# EAGLE design SPEKTRUM_Current_Usage_Sense REV_B (EAGLE 7.1.0)
Spektrum Telemetry Sensor Rev B
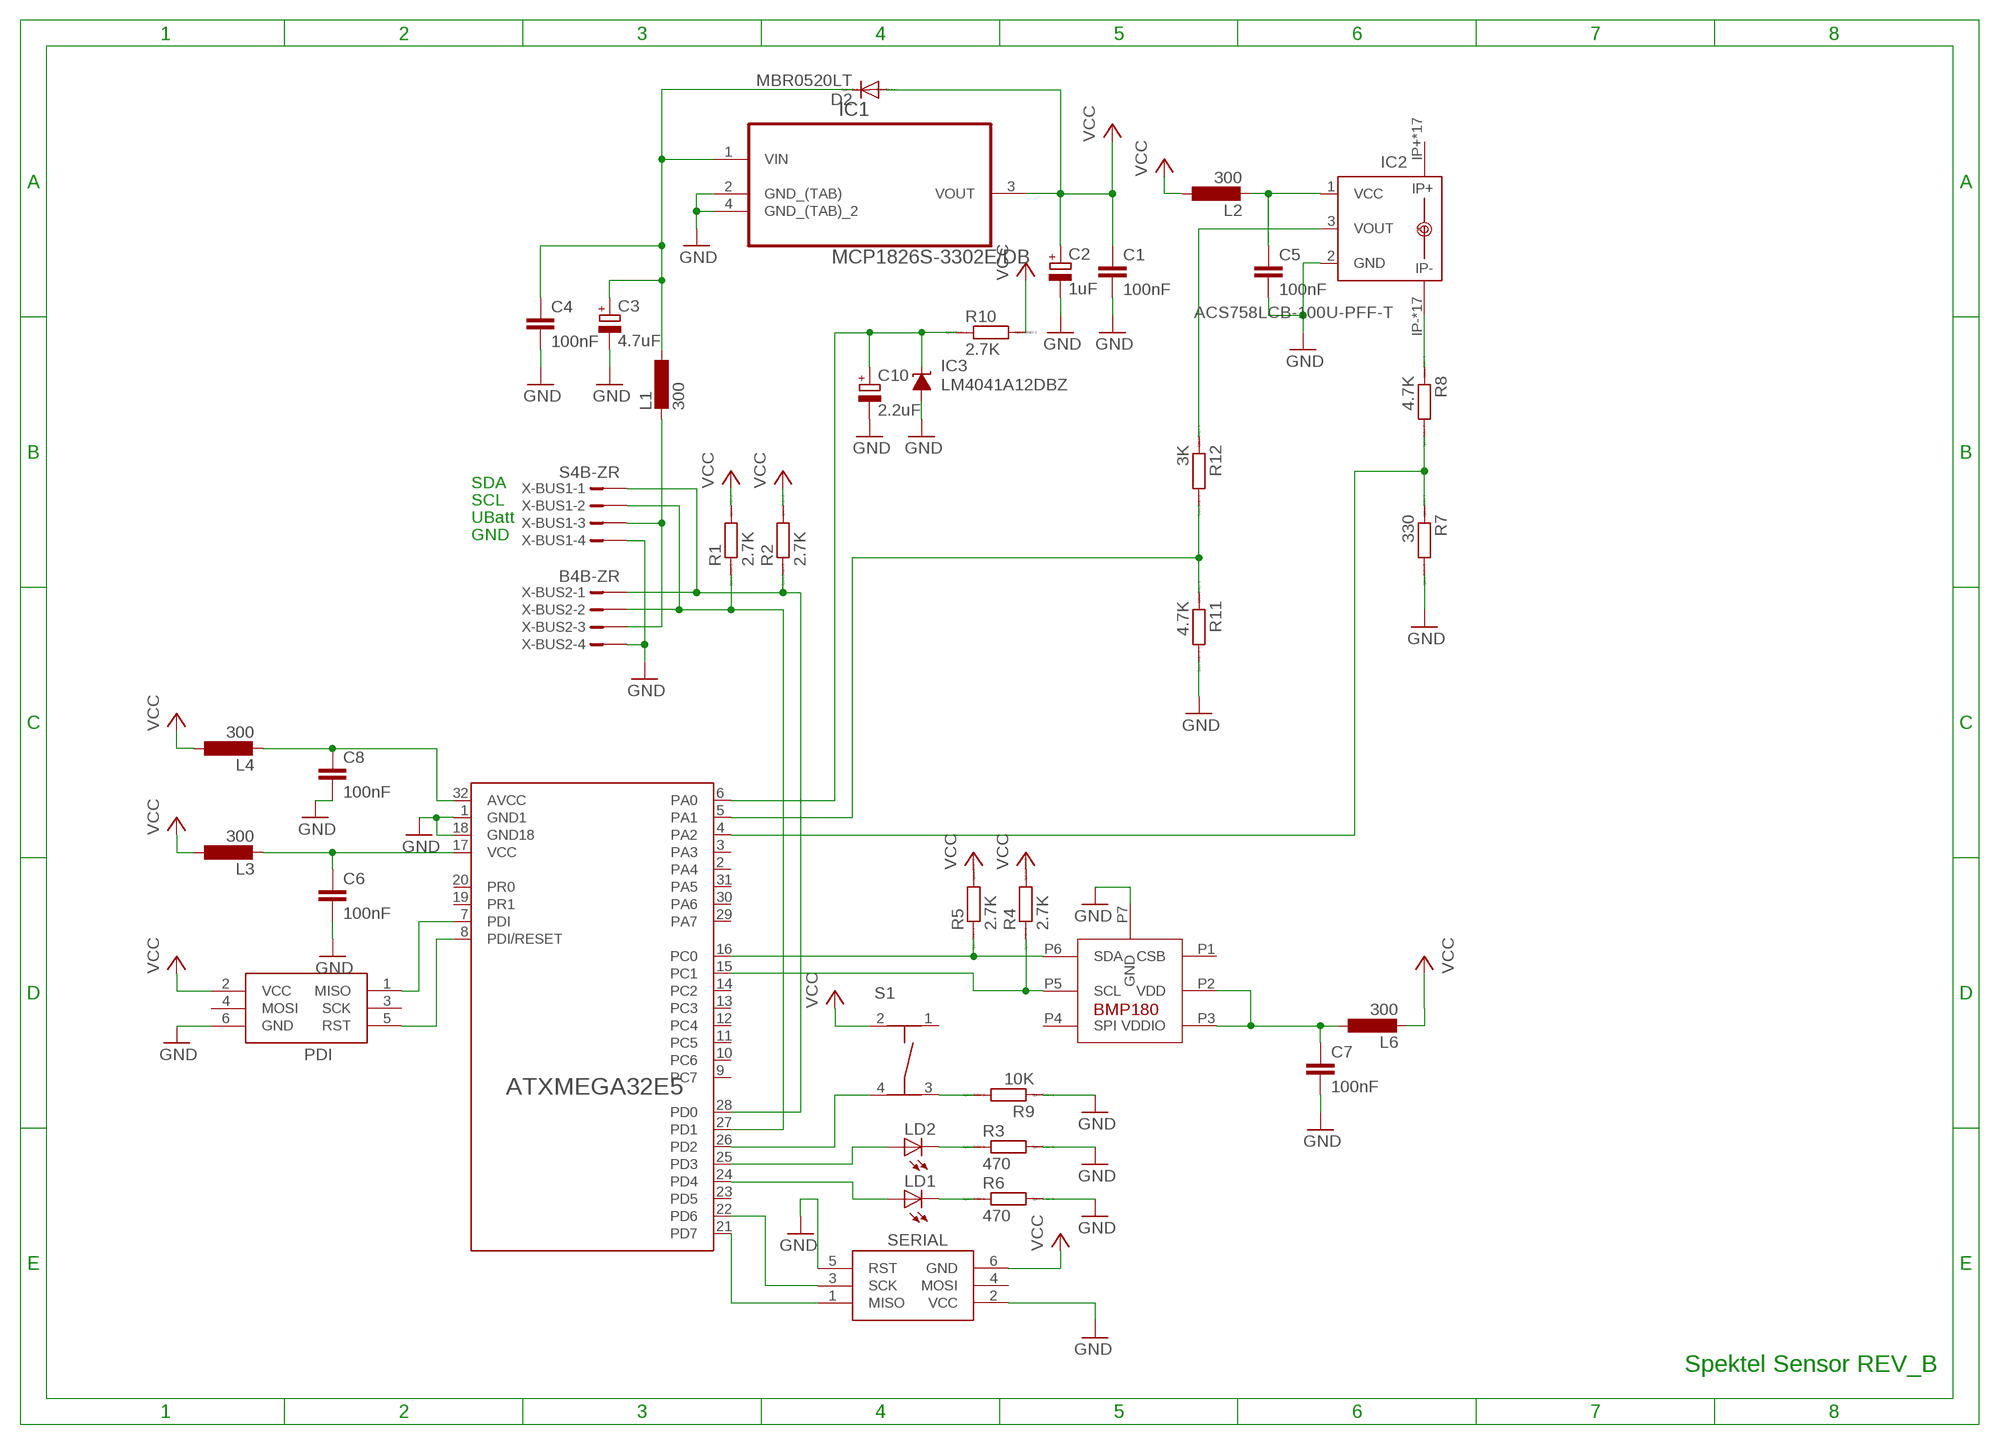
[diagram p0: schematic, sheet 1]

## Parts
ATXMEGA32E5  ATXMEGA32E5/16E5/8E5ATXMEGA32E5-AU  [TQFP32-08]
BMP180  BMP180  [BMP180_LGA7]
C1  100nF  C-EUC0603  [C0603]
C2  1uF  CPOL-EUA/3216-18W  [A/3216-18W]
C3  4.7uF  CPOL-EUA/3216-18W  [A/3216-18W]
C4  100nF  C-EUC0603  [C0603]
C5  100nF  C-EUC0603  [C0603]
C6  100nF  C-EUC0603  [C0603]
C7  100nF  C-EUC0603  [C0603]
C8  100nF  C-EUC0603  [C0603]
C10  2.2uF  CPOL-EUA/3216-18W  [A/3216-18W]
D2  MBR0520LT  [SOD123]
IC1  MCP1826S-3302E/DB  [SOT230P700X180-4N]
IC2  ACS758LCB-100U-PFF-T  ACS758LCB-100B-PFF-T  [CB-PFF]
IC3  LM4041A12DBZ  [DBZ_R-PDSO-G3]
L1  300  L-EU  [L0603]
L2  300  L-EU  [L0603]
L3  300  L-EU  [L0603]
L4  300  L-EU  [L0603]
L6  300  L-EU  [L0603]
LD1  LEDCHIPLED_0603  [CHIPLED_0603]
LD2  LEDCHIPLED_0603  [CHIPLED_0603]
PDI  AVRISP-6  [AVRISP]
R1  2.7K  R-EU_R0603  [R0603]
R2  2.7K  R-EU_R0603  [R0603]
R3  470  R-EU_R0603  [R0603]
R4  2.7K  R-EU_R0603  [R0603]
R5  2.7K  R-EU_R0603  [R0603]
R6  470  R-EU_R0603  [R0603]
R7  330  R-EU_R0603  [R0603]
R8  4.7K  R-EU_R0603  [R0603]
R9  10K  R-EU_R0603  [R0603]
R10  2.7K  R-EU_R0603  [R0603]
R11  4.7K  R-EU_R0603  [R0603]
R12  3K  R-EU_R0603  [R0603]
S1  TASTER-9314_SMD  [TASTER-9314_SMD]
SERIAL  AVRISP-6  [AVRISP]
X-BUS1  S4B-ZR  [S4B-ZR]
X-BUS2  B4B-ZR  [B4B-ZR]

## Nets
ADC_CURRENT: ATXMEGA32E5.5(PA1) R11.1 R12.2
ADC_VOLTAGE: ATXMEGA32E5.4(PA2) R7.1 R8.2
AREF: ATXMEGA32E5.6(PA0) C10.+ IC3.1(C) R10.1
AVCCMC: ATXMEGA32E5.32(AVCC) C8.1 L4.2
D_BUTTON: ATXMEGA32E5.26(PD2) S1.4
GND: ATXMEGA32E5.1(GND1) ATXMEGA32E5.18(GND18) BMP180.P7(GND) C1.2 C2.- C3.- C4.2 C5.2 C6.2 C7.2 C8.2 C10.- IC1.2(GND_(TAB)) IC1.4(GND_(TAB)_2) IC2.2(GND) IC3.2(A) PDI.6(GND) R3.2 R6.2 R7.2 R9.1 R11.2 SERIAL.2(VCC) SERIAL.5(RST) X-BUS1.4 X-BUS2.4
LED1: ATXMEGA32E5.24(PD4) LD1.A
LED2: ATXMEGA32E5.25(PD3) LD2.A
N$2: L1.2 X-BUS1.3 X-BUS2.3
N$3: LD2.C R3.1
N$4: C5.1 IC2.1(VCC) L2.2
N$6: LD1.C R6.1
N$7: BMP180.P2(VDD) BMP180.P3(VDDIO) C7.1 L6.1
N$8: R9.2 S1.3
N$10: IC2.3(VOUT) R12.1
N$12: ATXMEGA32E5.7(PDI) PDI.1(MISO)
N$13: ATXMEGA32E5.8(PDI/RESET) PDI.5(RST)
RXD0: ATXMEGA32E5.22(PD6) SERIAL.3(SCK)
SENS_CUR_-: IC2.IP- IC2.IP-@2(IP-) IC2.IP-@3(IP-) IC2.IP-@4(IP-) IC2.IP-@5(IP-) IC2.IP-@6(IP-) IC2.IP-@7(IP-) IC2.IP-@8(IP-) IC2.IP-@9(IP-) IC2.IP-@10(IP-) IC2.IP-@11(IP-) IC2.IP-@12(IP-) IC2.IP-@13(IP-) IC2.IP-@14(IP-) IC2.IP-@15(IP-) IC2.IP-@16(IP-) IC2.IP-@17(IP-) R8.1
TWIM_SCL: ATXMEGA32E5.15(PC1) BMP180.P5(SCL) R4.1
TWIM_SDA: ATXMEGA32E5.16(PC0) BMP180.P6(SDA) R5.1
TWIS_SCL: ATXMEGA32E5.27(PD1) R1.1 X-BUS1.2 X-BUS2.2
TWIS_SDA: ATXMEGA32E5.28(PD0) R2.1 X-BUS1.1 X-BUS2.1
TXD0: ATXMEGA32E5.21(PD7) SERIAL.1(MISO)
UBATT: C3.+ C4.1 D2.C IC1.1(VIN) L1.1
VCC: C1.1 C2.+ D2.A IC1.3(VOUT) L2.1 L3.1 L4.1 L6.2 PDI.2(VCC) R1.2 R2.2 R4.2 R5.2 R10.2 S1.2 SERIAL.6(GND)
VCCMC: ATXMEGA32E5.17(VCC) C6.1 L3.2
Unconnected: ATXMEGA32E5.2(PA4) ATXMEGA32E5.3(PA3) ATXMEGA32E5.9(PC7) ATXMEGA32E5.10(PC6) ATXMEGA32E5.11(PC5) ATXMEGA32E5.12(PC4) ATXMEGA32E5.13(PC3) ATXMEGA32E5.14(PC2) ATXMEGA32E5.19(PR1) ATXMEGA32E5.20(PR0) ATXMEGA32E5.23(PD5) ATXMEGA32E5.29(PA7) ATXMEGA32E5.30(PA6) ATXMEGA32E5.31(PA5) BMP180.P1(CSB) BMP180.P4(SPI) IC2.IP+ IC2.IP+@2(IP+) IC2.IP+@3(IP+) IC2.IP+@4(IP+) IC2.IP+@5(IP+) IC2.IP+@6(IP+) IC2.IP+@7(IP+) IC2.IP+@8(IP+) IC2.IP+@9(IP+) IC2.IP+@10(IP+) IC2.IP+@11(IP+) IC2.IP+@12(IP+) IC2.IP+@13(IP+) IC2.IP+@14(IP+) IC2.IP+@15(IP+) IC2.IP+@16(IP+) IC2.IP+@17(IP+) PDI.3(SCK) PDI.4(MOSI) S1.1 SERIAL.4(MOSI)

## Notes on the sheet
- SDA
- SCL
- UBatt
- GND
- Spektel Sensor REV_B

## Library data of the parts
ATXMEGA32E5 = atmega-atxmega:ATXMEGA32E5/16E5/8E5: 8/16-bit Atmel AVR XMEGA Microcontrollers
BMP180 = bosch_sensors:BMP180: BMP 180 Digital Pressure Sensor with I2C Interface
C1 C4-C8 = rcl:C-EU: CAPACITOR, European symbol
C2 C3 C10 = rcl:CPOL-EU: POLARIZED CAPACITOR, European symbol
D2 = diode:MBR0520LT: SCHOTTKY BARRIER RECTIFIER Source: http://onsemi.com .. MBR0520LT1-D.pdf
IC1 = microchip_ldo:MCP1826S-3302E/DB: IC, LDO, 3.3V, 1A; MPN: MCP1826S-3302E/DB; OC_FARNELL: 1578424; OC_NEWARK: 27M0037; PACKAGE: SOT-223-3; SUPPLIER: Microchip
IC2 = allegro:ACS758*: Thermally Enhanced, Fully Integrated, Hall Effect-Based Linear Current Sensor with 100 micro Ohm Current Conductor display layer 49 Reference in BRD and place VIAs on circles Source: http://www.allegromicro.com/en/Products/Part_Numbers/0758/0758.pdf; MPN: ACS758LCB-100U-PFF-T; OC_FARNELL: 1718998; OC_NEWARK: 04R7132
IC3 = texas:LM4041: PRECISION MICROPOWER SHUNT VOLTAGE REFERENCE Source: http://focus.ti.com/lit/ds/slcs146e/slcs146e.pdf; MPN: LM4041A12IDBZR; OC_FARNELL: 1407949; OC_NEWARK: 58K5875
L1-L4 L6 = rcl:L-EU: INDUCTOR, European symbol
LD1 LD2 = adafruit:LED: LED OSRAM: - CHIPLED LG R971, LG N971, LY N971, LG Q971, LY Q971, LO R971, LY R971 LH N974, LH R974 LS Q976, LO Q976, LY Q976 LO Q996 - Hyper CHIPLED LW Q18S LB Q993, LB Q99A, LB R99A - SideLED LS A670, LO A670, LY A670, LG A670, LP A670 LB A673, LV A673, LT A673, LW A673 LH A674 LY A675 LS A676, LA A676, LO A676, LY A676, LW A676 LS A679, LY A679, LG A679 - Hyper Micro SIDELED® LS Y876, LA Y876, LO Y876, LY Y876 LT Y87S - SmartLED LW L88C, LW L88S LB L89C, LB L89S, LG L890 LS L89K, LO L89K, LY L89K LS L896, LA L896, LO L896, LY L896 - TOPLED LS T670, LO T670, LY T670, LG T670, LP T670 LSG T670, LSP T670, LSY T670, LOP T670, LYG T670 LG T671, LOG T671, LSG T671 LB T673, LV T673, LT T673, LW T673 LH T674 LS T676, LA T676, LO T676, LY T676, LB T676, LH T676, LSB T676, LW T676 LB T67C, LV T67C, LT T67C, LS T67K, LO T67K, LY T67K, LW E67C LS E67B, LA E67B, LO E67B, LY E67B, LB E67C, LV E67C, LT E67C LW T67C LS T679, LY T679, LG T679 LS T770, LO T770, LY T770, LG T770, LP T770 LB T773, LV T773, LT T773, LW T773 LH T774 LS E675, LA E675, LY E675, LS T675 LS T776, LA T776, LO T776, LY T776, LB T776 LHGB T686 LT T68C, LB T68C - Hyper Mini TOPLED® LB M676 - Mini TOPLED Santana® LG M470 LS M47K, LO M47K, LY M47K Source: http://www.osram.convergy.de/
PDI SERIAL = adafruit:AVRISP: AVR ISP HEADER Standard 6 pin header for AVR programming
R1-R12 = resistor:R-EU_: RESISTOR, European symbol; SPICEPREFIX: R
S1 = Ergaenzung:TASTER-9314_SMD
X-BUS1 = con-jst:?4B-ZR: ZH CONNECTOR 1.5 mm, 4 pin 1 row Source: http://www.jst.com .. eZH.pdf; MF: FARNELL; MPN: S4B-ZR(LF)(SN); OC_FARNELL: 9491830; OC_NEWARK: 38K8076
X-BUS2 = con-jst:?4B-ZR: ZH CONNECTOR 1.5 mm, 4 pin 1 row Source: http://www.jst.com .. eZH.pdf; MF: FARNELL; MPN: B4B-ZR(LF)(SN); OC_FARNELL: 1830916; OC_NEWARK: 37K9960

## Board
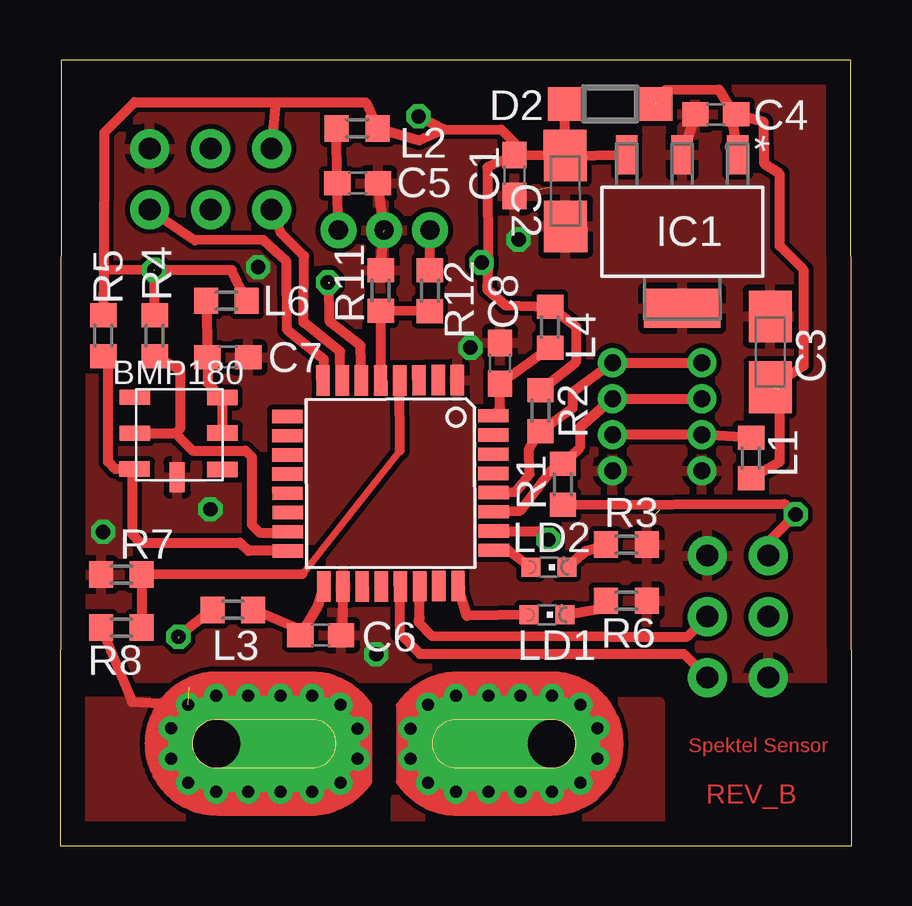
[diagram p1: board, top side]
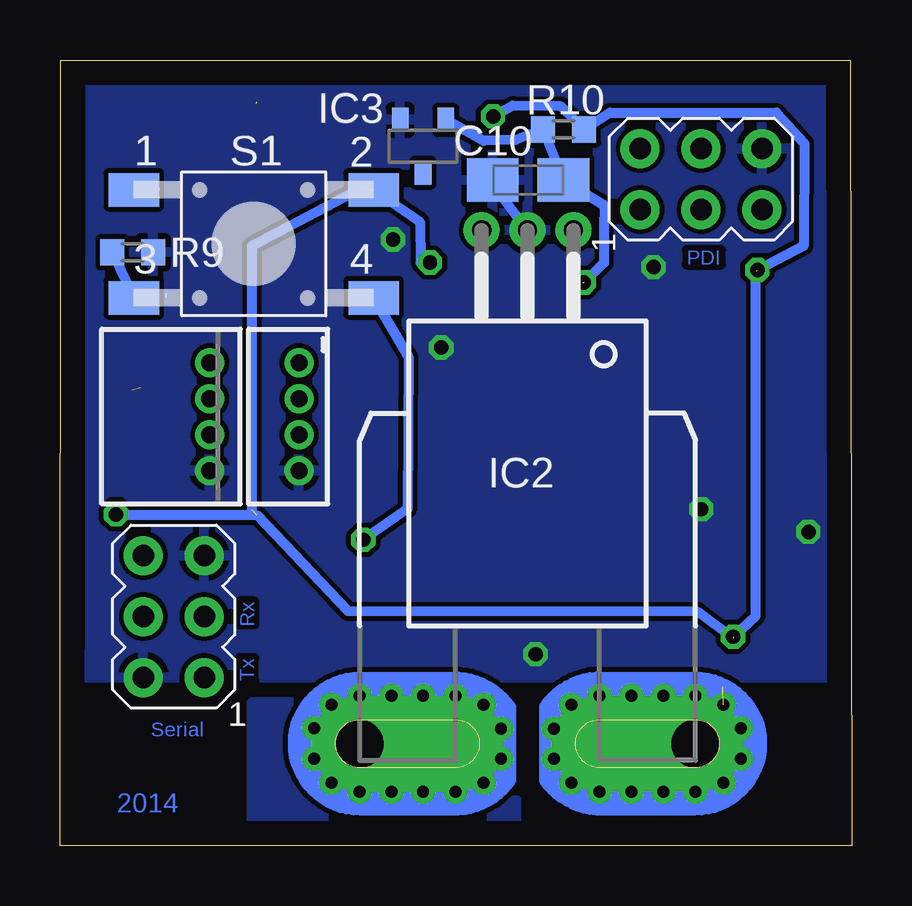
[diagram p2: board, bottom side, seen from below]

Size 33.01 x 32.74 mm. Coordinates in mm from the lower left corner, seen from the top.
Outline: 0,0 33.01,0 32.98,32.74 0.06,32.74 0,0
Copper layers (1*16): Top 0.035mm / dielectric 1.5mm / Bottom 0.035mm
Design rules "default *": minimum track width 10mil, minimum drill 17mil, track to track 8mil, track to pad 8mil, pad to pad 8mil, via to via 8mil, smd to smd 8mil, copper to edge 40mil, drill to drill 8mil, minimum pad ring 10mil, minimum via ring 8mil, stop-mask expansion 4mil, vias tented up to drill 0mil, thermal gap 10mil

### Footprints (pad centres in the part's own frame; a part is rotated, then mirrored left to right if it is on the bottom)
TQFP32-08 = smd 1.27 x 0.559: 1 -4.293,2.8; 2 -4.293,2; 3 -4.293,1.2; 4 -4.293,0.4; 5 -4.293,-0.4; 6 -4.293,-1.2; 7 -4.293,-2; 8 -4.293,-2.8; 17 4.293,-2.8; 18 4.293,-2; 19 4.293,-1.2; 20 4.293,-0.4; 21 4.293,0.4; 22 4.293,1.2; 23 4.293,2; 24 4.293,2.8 | smd 0.559 x 1.27: 9 -2.8,-4.293; 10 -2,-4.293; 11 -1.2,-4.293; 12 -0.4,-4.293; 13 0.4,-4.293; 14 1.2,-4.293; 15 2,-4.293; 16 2.8,-4.293; 25 2.8,4.293; 26 2,4.293; 27 1.2,4.293; 28 0.4,4.293; 29 -0.4,4.293; 30 -1.2,4.293; 31 -2,4.293; 32 -2.8,4.293
BMP180_LGA7 = smd 0.635 x 1.27: P1 1.455,1.685; P2 -0.065,1.695; P3 -1.545,1.685; P4 -1.555,-1.955; P5 -0.055,-1.955; P6 1.435,-1.975 | smd 1.27 x 0.635: P7 1.775,-0.195
C0603 = smd 1.1 x 1: 1 -0.85,0; 2 0.85,0
A/3216-18W = smd 2.15 x 1.8: + 1.475,0; - -1.475,0
SOD123 = smd 1.4 x 1.4: A 1.9,0; C -1.9,0
SOT230P700X180-4N = smd 1.626 x 0.889: 1 -3.2,2.311; 2 -3.2,0; 3 -3.2,-2.311 | smd 1.626 x 3.175: 4 3.2,0
CB-PFF = drill 0.8 pad 1.5: 1 -1.91,-21.4; 2 0,-21.4; 3 1.91,-21.4 | drill 2 pad 4 offset: IP+ 7,0; IP- -7,0 | drill 0.5 pad 0.9: IP+@2 8.89,0.635; IP+@3 8.89,-0.635; IP+@4 8.175,-1.625; IP+@5 7,-2; IP+@6 5.675,-2; IP+@7 4.35,-2; IP+@8 3,-2; IP+@9 1.825,-1.625; IP+@10 1.1,-0.625; IP+@11 1.1,0.625; IP+@12 1.825,1.625; IP+@13 3,2; IP+@14 4.35,2; IP+@15 5.675,2; IP+@16 7,2; IP+@17 8.175,1.625; IP-@2 -8.89,0.635; IP-@3 -8.89,-0.635; IP-@4 -8.175,-1.625; IP-@5 -7,-2; IP-@6 -5.675,-2; IP-@7 -4.325,-2; IP-@8 -3,-2; IP-@9 -1.825,-1.625; IP-@10 -1.1,-0.625; IP-@11 -1.1,0.625; IP-@12 -1.825,1.625; IP-@13 -3,2; IP-@14 -4.325,2; IP-@15 -5.675,2; IP-@16 -7,2; IP-@17 -8.175,1.625
DBZ_R-PDSO-G3 = smd 0.7 x 1: 1 -0.95,-1.1; 2 0.95,-1.1; 3 0,1.1
L0603 = smd 1 x 1.1: 1 -0.85,0; 2 0.85,0
CHIPLED_0603 = smd 0.8 x 0.8: A 0,-0.75; C 0,0.75
AVRISP = drill 0.9 pad 1.626: 1 -1.27,2.54; 2 1.27,2.54; 3 -1.27,0; 4 1.27,0; 5 -1.27,-2.54; 6 1.27,-2.54
R0603 = smd 1 x 1.1: 1 -0.85,0; 2 0.85,0
TASTER-9314_SMD = smd 2.1 x 1.4: 1 -5,2.25; 2 5,2.25; 3 -5,-2.25; 4 5,-2.25
S4B-ZR = drill 0.7 pad 1.1: 1 -2.25,0; 2 -0.75,0; 3 0.75,0; 4 2.25,0
B4B-ZR = drill 0.7 pad 1.1: 1 -2.25,0; 2 -0.75,0; 3 0.75,0; 4 2.25,0

### Placement (x,y rotation side)
ATXMEGA32E5  13.78,15.1 270.2 top
BMP180  5.08,17.13 270 top
C1  18.94,27.93 270 top
C2  21.07,27.28 90.3 top
C3  29.61,20.58 270 top
C4  27.34,30.47 180 top
C5  12.41,27.6 0 top
C6  10.87,8.78 0 top
C7  7,20.35 0 top
C8  18.35,20.1 90 top
C10  13.49,27.74 0 bottom
D2  22.94,30.91 180 top
IC1  25.94,25.59 270 top
IC2  13.52,4.25 180 bottom
IC3  17.87,29.15 180 bottom
L1  28.81,16.16 90 top
L2  12.39,29.89 180 top
L3  7.21,9.83 0 top
L4  20.43,21.61 270 top
L6  6.94,22.71 0 top
LD1  20.3,9.62 270 top
LD2  20.38,11.61 270 top
PDI  6.28,27.78 90 bottom
R1  20.97,15.06 270 top
R2  20.03,18.13 90 top
R3  23.61,12.55 0 top
R4  3.95,21.25 90 top
R5  1.81,21.25 90 top
R6  23.61,10.21 0 top
R7  2.56,11.3 180 top
R8  2.56,9.09 0 top
R9  29.97,24.73 180 bottom
R10  12.01,29.85 0 bottom
R11  13.37,23.14 90 top
R12  15.42,23.13 270 top
S1  24.93,25.08 0 bottom
SERIAL  28.26,9.55 180 bottom
X-BUS1  26.76,17.88 270 bottom
X-BUS2  23.04,17.88 270 bottom

### Tracks (layer width: path | path; a pad name or v marks a point on that pad's centre or on a via)
ADC_CURRENT
  Top 0.406: ATXMEGA32E5.5 R11.1 R12.2
ADC_VOLTAGE
  Top 0.305: 10.11,11.32 14.17,16.46
  Top 0.406: 14.17,16.46 ATXMEGA32E5.4 | R8.2 R7.1 10.11,11.32
AREF  (via drill 0.6)  (2 unrouted)
  Top 0.406: ATXMEGA32E5.6 12.54,20.83 11.24,21.83 11.21,23.47
  Bottom 0.406: 11.21,23.44 10.32,24.29 10.32,25.73 10.31,26.68 C10.+ R10.1 14,29.41 15.34,29.37 IC3.1
  other vias: 11.17,23.47
AVCCMC
  Top 0.406: ATXMEGA32E5.32 18.35,18.2 C8.1 L4.2
CENS_CUR_+
  pour Bottom: 14,6 14,0 25,0 25,6
D_BUTTON  (via drill 0.6)
  Top 0.406: ATXMEGA32E5.26 20,13.12 v20.36,12.75
  Bottom 0.406: S1.4 18.47,20.35 18.51,14.05 v20.36,12.75
GND  (via drill 0.6)  (1 unrouted)
  Top 0.406: 26.15,29 IC1.2 C4.2 | C6.2 11.79,9.06 ATXMEGA32E5.18 | 18.3,21 C8.2 | R11.2 IC2.2 C5.2
  Bottom 0.406: 13.47,25.57 15.03,27.69
  other vias: 6.27,14.02 13.18,7.98 17.11,20.76 1.8,13.08 19.12,25.26 8.26,24.11
  pour Top: 0,34 0,7 32,7 32,34
  pour Bottom: 0,34 0,7 32,7 32,34
LED1
  Top 0.406: LD1.A 16.96,9.58 ATXMEGA32E5.24
LED2
  Top 0.406: ATXMEGA32E5.25 18.68,12.31 LD2.A
N$1
  pour Top: 14,0 14,6 25,6 25,0
N$2
  Top 0.406: L1.2 X-BUS1.3 X-BUS2.3
N$3
  Top 0.406: LD2.C 21.9,12.28 R3.1
N$4
  Top 0.406: IC2.1 C5.1 L2.2
N$6
  Top 0.406: LD1.C 22.41,9.86 R6.1
N$7
  Top 0.406: BMP180.P2 6.76,17.2 BMP180.P3 6.15,19.29 C7.1 | 5.85,20.65 C7.1 | L6.1 C7.1
N$8
  Bottom 0.406: R9.2 S1.3
N$10
  Top 0.406: R12.1 IC2.3
N$12
  Top 0.406: ATXMEGA32E5.7 11.69,19.46 11.68,20.59 10.15,21.81 10.18,24.57 9.21,25.53 PDI.1
N$13
  Top 0.406: ATXMEGA32E5.8 11,20.26 9.47,21.49 9.44,24.35 8.47,25.25 5.62,25.22 PDI.5
RXD0
  Top 0.406: ATXMEGA32E5.22 14.99,9.48 14.96,9.3 15.52,8.74 22.93,8.71 26.15,8.71 SERIAL.3
SENS_CUR_-  (1 unrouted)
  Top 0.406: 5.38,6.62 7,5 | R8.1 3,6 IC2.IP-@4
  pour Top: 13,0 13,6 0,6 0,0
  pour Bottom: 0,6 0,0 13,0 13,6
TWIM_SCL
  Top 0.406: BMP180.P5 4.82,17.18 | 4.82,17.18 5,17 5,16.99 5.53,16.46 7.73,16.46 7.99,16.2 7.99,13.38 8.32,13.05 9.46,13.05 ATXMEGA32E5.15 | 4.82,17.18 5,17.37 5,19.83 R4.1
TWIM_SDA
  Top 0.406: ATXMEGA32E5.16 7.86,12.29 7.51,12.63 3.37,12.63 3,13 3,15.59 BMP180.P6 2.31,15.7 2,16 2,20.21 R5.1
TWIS_SCL
  Top 0.406: ATXMEGA32E5.27 19.19,13.96 20.46,15.62 R1.1 21.67,16.59 21.67,17.43 X-BUS2.2 X-BUS1.2
TWIS_SDA
  Top 0.406: ATXMEGA32E5.28 19.02,14.76 19.26,15.07 19.58,15.49 19.56,16.56 19.58,16.58 R2.1 21.38,18.25 21.39,18.91 X-BUS2.1 X-BUS1.1
TXD0
  Top 0.406: ATXMEGA32E5.21 14.18,10.79 14.18,8.83 15,8.01 15,8 26,8 SERIAL.1
UBATT  (2 unrouted)
  Top 0.406: 27.92,30.78 C4.1 29.34,30.15 29.37,28.4 30,28 30,25 31,24 31,20 C3.+ | 27.92,29.12 IC1.1 27.92,30.78 | L1.1 30,16 30,19 | 27.92,30.78 27.48,31.51 25.2,31.47 24.81,30.98
VCC  (via drill 0.6)  (4 unrouted)
  Top 0.406: C2.+ C1.1 17.82,28.27 17.84,24.13 | 16,29.86 14.97,29.39 L2.1 12.76,30.97 9,30.97 | 16,29.86 18.4,29.84 18.94,29.3 | 1.82,24 1.85,29.71 3.11,30.98 7.54,30.98 9,30.97 | 1.82,24 R5.2 | L3.1 5.44,9.13 v4.94,8.71 | 17.84,24.13 17.8,23.18 18.58,22.52 L4.1 21.53,21.61 21.53,20.17 R2.2 | L6.2 7.16,23.98 v3.93,23.99 1.82,24 | R4.2 3.95,23.95 4,24 | v17.58,24.3 17.84,24.13 | R1.2 30.2,14.25 v30.67,13.81 29.53,12.67 SERIAL.6 | D2.A C2.+ | C2.+ IC1.3 | PDI.2 9,30.97 | v14.95,30.39 16,29.86
  Bottom 0.406: v4.94,8.71 4,9.58 4,23.92 v3.93,23.99 2,25 1.98,29.28 3.14,30.55 10.07,30.55 R10.2 12.13,30.81 14.12,30.84 v14.95,30.39 | S1.2 18,26 17.98,24.3 v17.58,24.3 | 4.93,8.64 6.42,9.75 21,9.78 24.78,13.77 30.37,13.77 v30.67,13.81 | 25,14 25,25 20.41,27.41
VCCMC
  Top 0.406: L3.2 10,9 C6.1 10.73,9.98 ATXMEGA32E5.17

### Text on the board
Top: Spektel Sensor | REV_B
Bottom: PDI | Rx | Tx | Serial | 2014